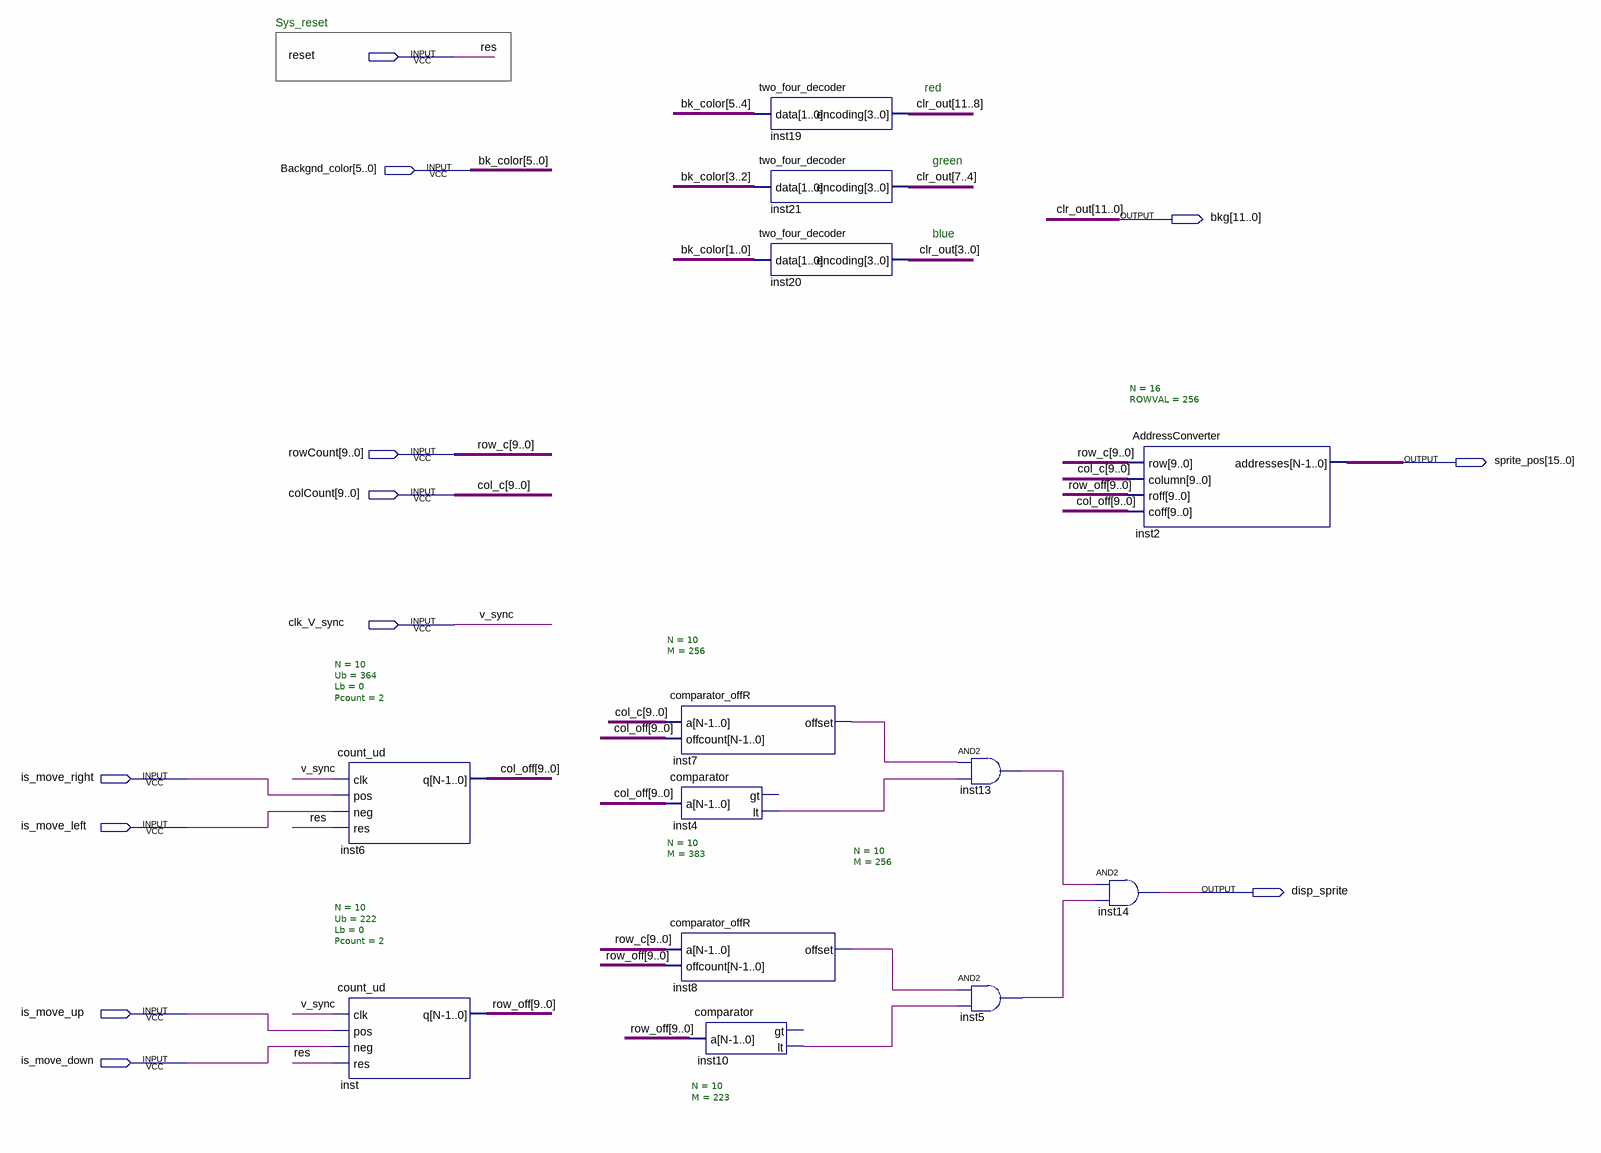
[diagram p0: schematic sheet]
// Quartus schematic Sprite_Position_Parser.bdf as structural Verilog: 13 symbols, 12 pins
module Sprite_Position_Parser (
  input  reset,
  input  [5:0] Backgnd_color,
  input  [9:0] rowCount,
  input  [9:0] colCount,
  input  clk_V_sync,
  input  is_move_right,
  input  is_move_left,
  input  is_move_up,
  input  is_move_down,
  output [11:0] bkg,
  output [15:0] sprite_pos,
  output disp_sprite
);

  wire inst4_lt, inst5_out, inst7_offset, inst8_offset, inst10_lt, inst13_out;
  wire [9:0] col_off, row_off;

  count_ud #(.N(10), .Ub(364), .Lb(0), .Pcount(2)) inst6 (
    .clk(clk_V_sync), .pos(is_move_right), .neg(is_move_left), .res(reset), .q(col_off));
  count_ud #(.N(10), .Ub(222), .Lb(0), .Pcount(2)) inst (
    .clk(clk_V_sync), .pos(is_move_up), .neg(is_move_down), .res(reset), .q(row_off));
  comparator_offR #(.N(10), .M(256)) inst7 (.a(colCount), .offcount(col_off), .offset(inst7_offset));
  comparator #(.N(10), .M(383)) inst4 (.a(col_off), .lt(inst4_lt));  // open: gt
  comparator_offR #(.N(10), .M(256)) inst8 (.a(rowCount), .offcount(row_off), .offset(inst8_offset));
  comparator #(.N(10), .M(223)) inst10 (.a(row_off), .lt(inst10_lt));  // open: gt
  two_four_decoder inst19 (.data(Backgnd_color[5:4]), .encoding(bkg[11:8]));
  two_four_decoder inst21 (.data(Backgnd_color[3:2]), .encoding(bkg[7:4]));
  two_four_decoder inst20 (.data(Backgnd_color[1:0]), .encoding(bkg[3:0]));
  and inst13 (inst13_out, inst7_offset, inst4_lt);
  and inst5 (inst5_out, inst8_offset, inst10_lt);
  AddressConverter #(.N(16), .ROWVAL(256)) inst2 (
    .row(rowCount), .column(colCount), .roff(row_off), .coff(col_off), .addresses(sprite_pos));
  and inst14 (disp_sprite, inst13_out, inst5_out);

  // Other names for the same wires on the sheet: bk_color[5:0] = Backgnd_color; clr_out[11:0] = bkg;
  //   col_c[9:0] = colCount; res = reset; row_c[9:0] = rowCount; v_sync = clk_V_sync

  // Notes on the sheet:
  //   Sys_reset
  //   red
  //   green
  //   blue
endmodule
